# EasyEDA Pro project project.epro, board Core Memory Line Driver Block v2
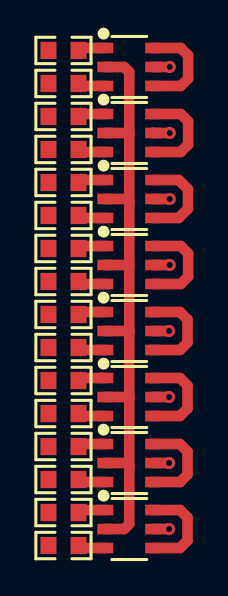
[diagram p2: board, top side]
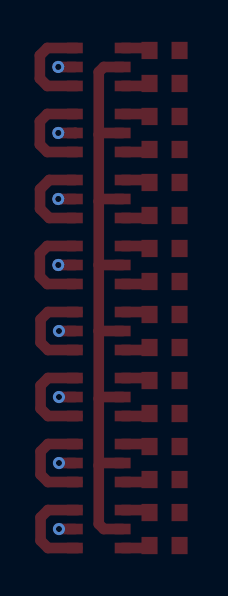
[diagram p3: board, bottom side, seen from below]

No outline. copper layers: Top Layer, Bottom Layer. Coordinates in mm from the lowest, leftmost part position.
Stack: Top Layer 0.035mm / Dielectric1 1.51mm FR4 er 4.5 / Bottom Layer 0.035mm

## Design rules (mm)
template: JLCPCB Capability(Two Layers Board)
spacing copperThickness1oz (default): track to track 0.102, other pairs 0.152 to 0.3
spacing copperThickness2oz: track to track 0.203, other pairs 0.152 to 0.3
track width copperThickness1oz (default): min 0.127, default 0.254, max 2.54
track width copperThickness2oz: min 0.203, default 0.254, max 2.54
differential pair differentialPair (default): width min 0.127, default 0.254, max 2.54; gap min 0.152, default 0.152
via viaSize (default): diameter min 0.5, default 0.61, max 10; hole min 0.3, default 0.305, max 6.3

## Placement (name value [footprint] x y rotation side)
Q1  DMG6602SVT-7  [TSOT-23-6_L2.9-W1.6-P0.95-LS2.8-BR]  3.3 23.94 180 top
Q2  DMG6602SVT-7  [TSOT-23-6_L2.9-W1.6-P0.95-LS2.8-BR]  3.3 20.64 180 top
Q3  DMG6602SVT-7  [TSOT-23-6_L2.9-W1.6-P0.95-LS2.8-BR]  3.3 17.34 180 top
Q4  DMG6602SVT-7  [TSOT-23-6_L2.9-W1.6-P0.95-LS2.8-BR]  3.3 14.03 180 top
Q5  DMG6602SVT-7  [TSOT-23-6_L2.9-W1.6-P0.95-LS2.8-BR]  3.3 10.73 180 top
Q6  DMG6602SVT-7  [TSOT-23-6_L2.9-W1.6-P0.95-LS2.8-BR]  3.3 7.43 180 top
Q7  DMG6602SVT-7  [TSOT-23-6_L2.9-W1.6-P0.95-LS2.8-BR]  3.3 4.13 180 top
Q8  DMG6602SVT-7  [TSOT-23-6_L2.9-W1.6-P0.95-LS2.8-BR]  3.3 0.83 180 top
R5  150Ω  [R0603]  0 24.77 0 top
R6  150Ω  [R0603]  0 23.11 0 top
R7  150Ω  [R0603]  0 21.46 0 top
R8  150Ω  [R0603]  0 19.81 0 top
R9  150Ω  [R0603]  0 18.16 0 top
R10  150Ω  [R0603]  0 16.51 0 top
R11  150Ω  [R0603]  0 14.86 0 top
R12  150Ω  [R0603]  0 13.21 0 top
R13  150Ω  [R0603]  0 11.56 0 top
R14  150Ω  [R0603]  0 9.91 0 top
R15  150Ω  [R0603]  0 8.25 0 top
R16  150Ω  [R0603]  0 6.6 0 top
R17  150Ω  [R0603]  0 4.95 0 top
R18  150Ω  [R0603]  0 3.3 0 top
R19  150Ω  [R0603]  0 1.65 0 top
R20  150Ω  [R0603]  0 0 0 top

## Footprints (pads in the part's own frame, mm; a bottom-side part is the same pattern mirrored in y, then rotated)
R0603
  rect 0.806x0.864 smd: 1(-0.753,0) 2(0.753,0)
TSOT-23-6_L2.9-W1.6-P0.95-LS2.8-BR
  rect 0.8x0.532 smd: 1(1.2,-0.95) 2(1.2,0) 3(1.2,0.95) 4(-1.2,0.95) 5(-1.2,0) 6(-1.2,-0.95)

## Nets
As in the schematic.

## Via types
v1: diameter 0.61, hole 0.305, Top Layer to Bottom Layer, 8 vias

## Routing (per net, layer and track width the routed paths; a pad name or vN(x,y) marks a point on that pad's centre or on a via; arc(x,y) is an arc through that point)
GND: length 6.5
  Top Layer w0.533: Q5.5 v1(5.3,10.73) ; Q4.5 v1(5.33,14.03) ; v1(5.33,20.64) 4.48,20.64 4.48,20.64 4.47,20.64 ; Q7.5 v1(5.3,4.13) ; Q1.5 v1(5.33,23.94) ; Q6.5 v1(5.3,7.43) ; Q3.5 v1(5.33,17.34) ; Q8.5 v1(5.3,0.83)
VCC: length 32.6
  Top Layer w0.533: 3.3,4.01 3.3,1.08 3.05,0.83 Q8.2 ; 3.3,4.01 3.3,7.35 ; 3.3,4.01 3.18,4.13 Q7.2 ; 3.3,7.35 3.22,7.43 Q6.2 ; 3.3,7.35 3.3,10.73 ; 3.3,20.55 3.3,23.69 3.05,23.94 Q1.2 ; 3.3,20.55 3.3,17.22 ; 3.3,20.55 3.22,20.64 Q2.2 ; Q3.2 3.18,17.34 3.3,17.22 ; 3.3,17.22 3.3,14.03 ; Q5.2 3.3,10.73 ; 3.3,10.73 3.3,14.03 ; 3.3,14.03 Q4.2
OUT0: length 5.2
  Top Layer w0.533: 4.41,22.99 5.88,22.99 6.26,23.36 6.26,24.52 5.88,24.89 4.41,24.89
OUT1: length 5.2
  Top Layer w0.533: 4.41,21.59 5.88,21.59 6.26,21.21 6.26,20.06 5.88,19.69 4.41,19.69
OUT2: length 4.9
  Top Layer w0.533: Q3.4 5.79,16.39 6.25,16.85 6.25,17.82 5.79,18.29 Q3.6
OUT3: length 5
  Top Layer w0.533: Q4.6 5.88,14.98 6.26,14.61 6.26,13.46 5.88,13.08 Q4.4
OUT4: length 5.2
  Top Layer w0.533: 4.38,9.78 5.85,9.78 6.22,10.16 6.22,11.31 5.85,11.68 4.38,11.68
OUT5: length 5.2
  Top Layer w0.533: 4.38,6.48 5.85,6.48 6.22,6.85 6.22,8.01 5.85,8.38 4.38,8.38
OUT6: length 5.2
  Top Layer w0.533: 4.38,5.08 5.85,5.08 6.22,4.7 6.22,3.55 5.85,3.18 4.38,3.18
OUT7: length 5.2
  Top Layer w0.533: 4.38,-0.12 5.85,-0.12 6.22,0.25 6.22,1.4 5.85,1.78 4.38,1.78
$1N959: length 1.4
  Top Layer w0.533: R5.2 0.88,24.89 Q1.1
$1N972: length 1.4
  Top Layer w0.533: Q2.1 0.88,21.59 R7.2
$1N982: length 1.4
  Top Layer w0.533: Q2.3 0.88,19.69 R8.2
$1N1257: length 1.4
  Top Layer w0.533: R11.2 0.88,14.98 Q4.1
$1N1261: length 1.4
  Top Layer w0.533: R10.2 0.88,16.39 Q3.3
$1N1273: length 1.4
  Top Layer w0.533: R9.2 0.88,18.29 Q3.1
$1N2409: length 1.4
  Top Layer w0.533: R6.2 0.88,22.99 Q1.3
$1N2651: length 1.4
  Top Layer w0.533: R12.2 0.88,13.08 Q4.3
$1N7281: length 1.4
  Top Layer w0.533: R15.2 0.88,8.38 Q6.1
$1N7282: length 1.4
  Top Layer w0.533: Q6.3 0.88,6.48 R16.2
$1N7283: length 1.4
  Top Layer w0.533: Q7.1 0.88,5.08 R17.2
$1N7284: length 1.4
  Top Layer w0.533: R18.2 0.88,3.18 Q7.3
$1N7285: length 1.4
  Top Layer w0.533: Q8.1 0.88,1.78 R19.2
$1N7286: length 1.4
  Top Layer w0.533: R20.2 0.88,-0.12 Q8.3
$1N7287: length 1.4
  Top Layer w0.533: Q5.1 0.88,11.68 R13.2
$1N7288: length 1.4
  Top Layer w0.533: Q5.3 0.88,9.78 R14.2
